# Altium schematic sheet SDCARD.SchDoc
size A3; SheetNumber: 10; SheetTotal: 23
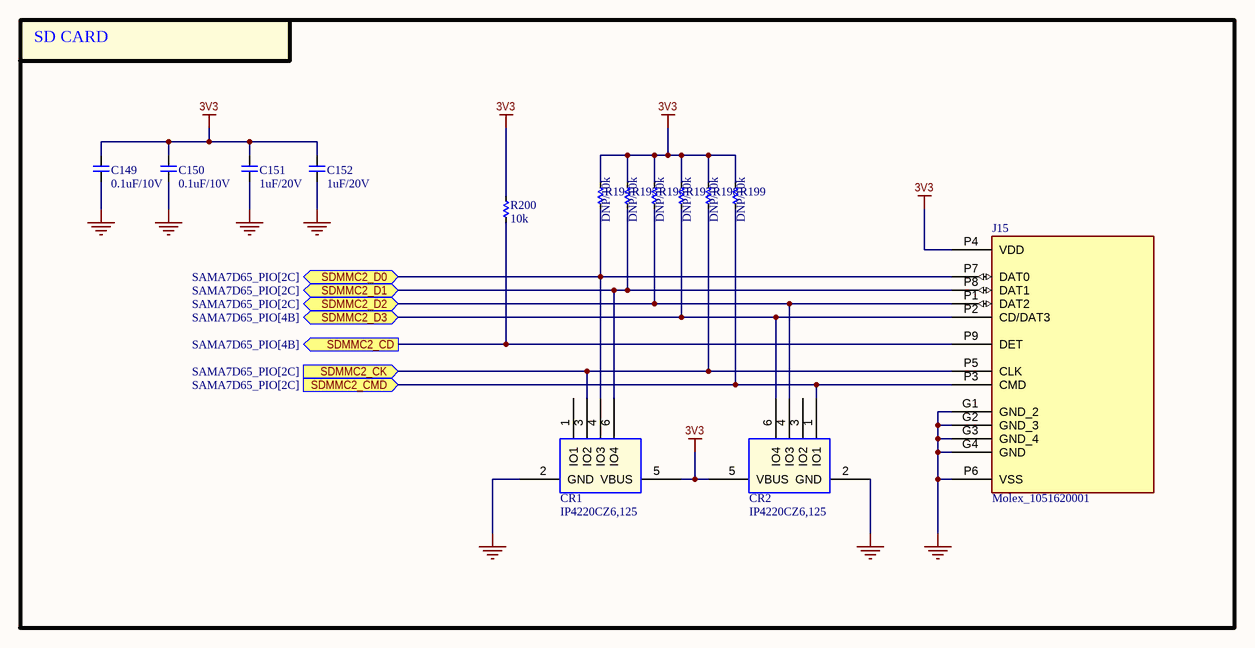
[diagram p0: SDCARD.SchDoc]

## Parts
C149  0.1uF/10V  [CAP_C_1005X50_L]
C150  0.1uF/10V  [CAP_C_1005X50_L]
C151  1uF/20V  [CAP_C_1005X50_L]
C152  1uF/20V  [CAP_C_1005X50_L]
CR1  IP4220CZ6,125  [DIODE_SOT457_1P7X3P1_NEX]
CR2  IP4220CZ6,125  [DIODE_SOT457_1P7X3P1_NEX]
J15  Molex_1051620001  [MOLEX_1051620001]
R194  DNP/10k  [RES_C_1005x30_L]
R195  DNP/10k  [RES_C_1005x30_L]
R196  DNP/10k  [RES_C_1005x30_L]
R197  DNP/10k  [RES_C_1005x30_L]
R198  DNP/10k  [RES_C_1005x30_L]
R199  DNP/10k  [RES_C_1005x30_L]
R200  10k  [RES_C_1005x30_L]

## Blocks framed on the sheet
SD CARD: C149-C152 CR1 CR2 J15 R194-R200

## Ports
SDMMC2_CD (out, see SAMA7D65_PIO[4B]), SDMMC2_CK (in, see SAMA7D65_PIO[2C]), SDMMC2_CMD (in, see SAMA7D65_PIO[2C]), SDMMC2_D0 (bidir, see SAMA7D65_PIO[2C]), SDMMC2_D1 (bidir, see SAMA7D65_PIO[2C]), SDMMC2_D2 (bidir, see SAMA7D65_PIO[2C]), SDMMC2_D3 (bidir, see SAMA7D65_PIO[4B])

## Nets
3V3: C149.2 C150.2 C151.2 C152.2 CR1.5(VBUS) CR2.5(VBUS) J15.P4(VDD) R194.2 R195.2 R196.2 R197.2 R198.2 R199.2 R200.2
GND: C149.1 C150.1 C151.1 C152.1 CR1.2(GND) CR2.2(GND) J15.G1(GND_2) J15.G2(GND_3) J15.G3(GND_4) J15.G4(GND) J15.P6(VSS)
SDMMC2_CD: J15.P9(DET) R200.1 ; port SDMMC2_CD
SDMMC2_CK: CR1.3(IO2) J15.P5(CLK) R198.1 ; port SDMMC2_CK
SDMMC2_CMD: CR2.1(IO1) J15.P3(CMD) R199.1 ; port SDMMC2_CMD
SDMMC2_D0: CR1.4(IO3) J15.P7(DAT0) R194.1 ; port SDMMC2_D0
SDMMC2_D1: CR1.6(IO4) J15.P8(DAT1) R195.1 ; port SDMMC2_D1
SDMMC2_D2: CR2.4(IO3) J15.P1(DAT2) R196.1 ; port SDMMC2_D2
SDMMC2_D3: CR2.6(IO4) J15.P2(CD/DAT3) R197.1 ; port SDMMC2_D3

Not connected (* = marked no-connect by the designer): CR1 1(IO1); CR2 3(IO2)

## Notes on the sheet
- Project:
- Page Contents:
- Revision:
- Design:
- Date:
- Size:
- A3
- Document Number:
- Sheet:
- of

## Library data of the parts
C149-C152 = _CAP_C_2: CAP CHIP
CR1 CR2 = IP4220CZ6,125: TVS DIODE 5.5VWM 6TSOP; Manufacturer_Name: Nexperia; Copyright: Copyright (C) 2025 Ultra Librarian. All rights reserved.; Manufacturer_Part_Number: IP4220CZ6,125; RefDes: RefDes; Type: Type
J15 = Molex_1051620001: 9 (8 + 1) Position Card Connector Secure Digital - microSDâ„¢ Surface Mount, Right Angle Gold; MF: Molex; SnapEDA_Link: https://www.snapeda.com/parts/1051620001/Molex/view-part/?ref=snap; Package: None; Value: *; MP: 1051620001; Check_prices: https://www.snapeda.com/parts/1051620001/Molex/view-part/?ref=eda
R194-R200 = _RES_B_2: RES